# EAGLE design Rauchmelder 2.1b (EAGLE 6.2)
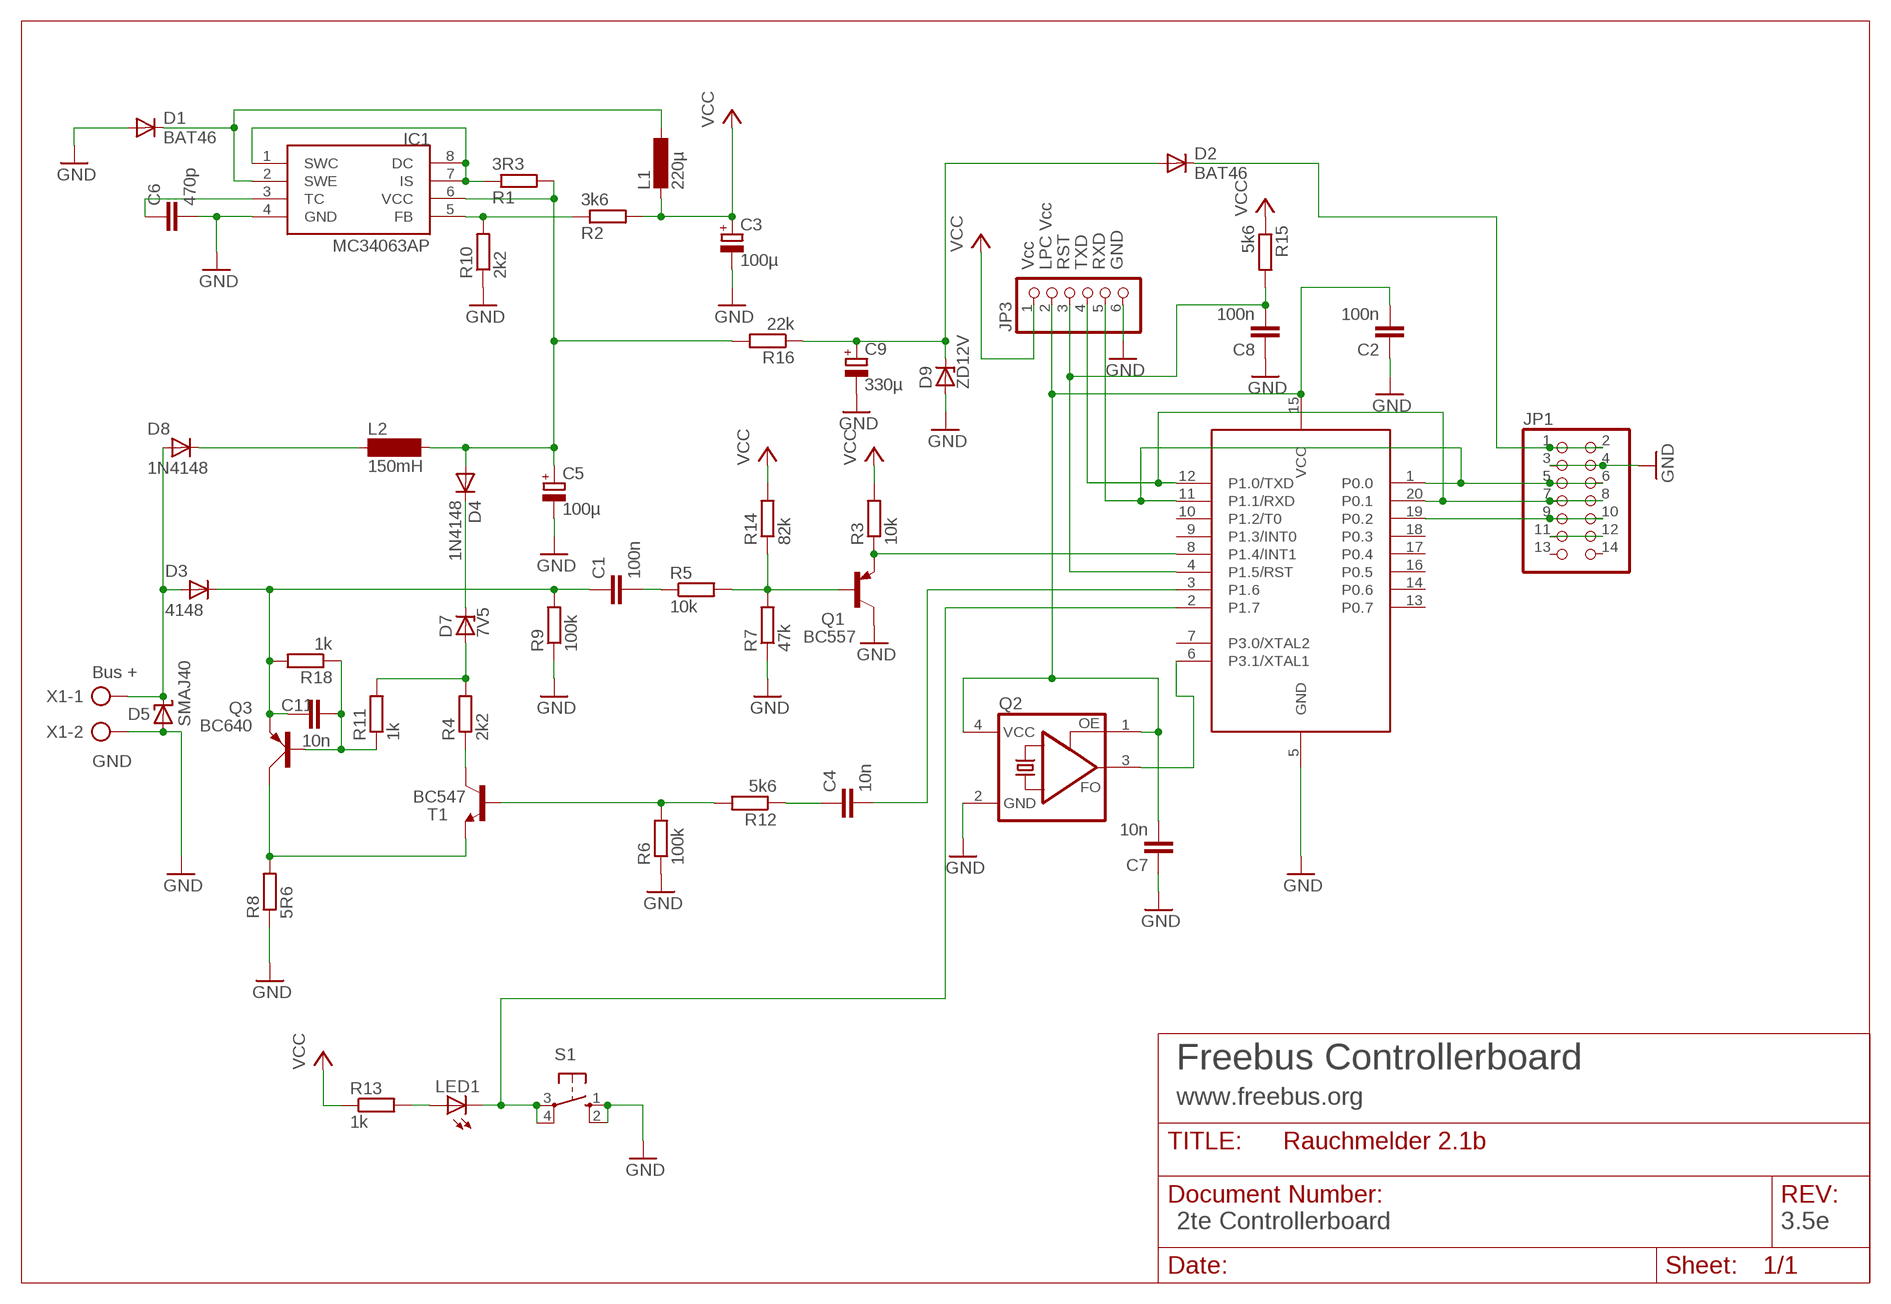
[diagram p0: schematic, sheet 1]

## Parts
89LPC922  89LPC922  [DIL20]
C1  100n  C-EU025-024X044  [C025-024X044]
C2  100n  C-EU025-024X044  [C025-024X044]
C3  100µ  CPOL-EUE2.5-6  [E2,5-6]
C4  10n  C-EU025-024X044  [C025-024X044]
C5  100µ  CPOL-EUE3.5-8  [E3,5-8]
C6  470p  C-EU025-024X044  [C025-024X044]
C7  10n  C-EUC1206  [C1206]
C8  100n  C-EU025-024X044  [C025-024X044]
C9  330µ  CPOL-EUE3.5-8  [E3,5-8]
C11  10n  C-EU025-024X044  [C025-024X044]
D1  BAT46  BAT81  [DO34-7]
D2  BAT46  BAT81  [DO34-7]
D3  4148  DO35-STEHEND  [DO35-S]
D4  1N4148  [DO35-10]
D5  SMAJ40  SUPPRESSOR-SMBJ  [SMBJ]
D7  7V5  BZX85ZDIOV  [ZDIO-2.5]
D8  1N4148  DO35-STEHEND  [DO35-S]
D9  ZD12V  BZX90  [DO34Z7]
IC1  MC34063AP  [DIL08]
JP1  PINHD-2X7  [2X07]
JP3  PINHD-1X6  [1X06]
L1  220µ  L-EU0207/12  [0207/12]
L2  150mH  BS11  [BS11]
LED1  LED3MM  [LED3MM]
Q1  BC557  [TO92]
Q2  ASFL  [ASF]
Q3  BC640  [SOT54D]
R1  3R3  R-EU_0207/7  [0207/7]
R2  3k6  R-EU_0207/7  [0207/7]
R3  10k  R-EU_0207/7  [0207/7]
R4  2k2  R-EU_0207/2V  [0207/2V]
R5  10k  R-EU_0207/7  [0207/7]
R6  100k  R-EU_0207/2V  [0207/2V]
R7  47k  R-EU_0207/7  [0207/7]
R8  5R6  R-EU_0207/2V  [0207/2V]
R9  100k  R-EU_0207/7  [0207/7]
R10  2k2  R-EU_0207/7  [0207/7]
R11  1k  R-EU_0207/2V  [0207/2V]
R12  5k6  R-EU_0207/7  [0207/7]
R13  1k  R-EU_0207/7  [0207/7]
R14  82k  R-EU_0207/7  [0207/7]
R15  5k6  R-EU_0207/2V  [0207/2V]
R16  22k  R-EU_0207/2V  [0207/2V]
R18  1k  R-EU_0207/2V  [0207/2V]
S1  10-XX  [B3F-10XX]
T1  BC547  [TO92]
X1  AK500/2  [AK500/2]

## Nets
EIB+: D3.P$1(A) D5.C D8.P$1(A) X1.1
GND: 89LPC922.5(GND) C2.1 C3.- C5.- C6.2 C7.1 C8.1 C9.- D1.A D5.A D9.A IC1.4(GND) JP1.3 JP1.4 JP3.6 Q1.3(C) Q2.2(GND) R6.1 R7.1 R8.1 R9.1 R10.1 S1.1(S) S1.2(S1) X1.2
N$1: 89LPC922.8(P1.4/INT1) Q1.1(E) R3.1
N$2: Q1.2(B) R5.2 R7.2 R14.1
N$3: 89LPC922.6(P3.1/XTAL1) Q2.3(FO)
N$4: C11.2 Q3.B R11.1 R18.1
N$5: 89LPC922.3(P1.6) C4.2
N$6: 89LPC922.15(VCC) C2.2 C7.2 JP3.2 Q2.1(OE) Q2.4(VCC)
N$7: 89LPC922.2(P1.7) LED1.K(C) S1.3(P) S1.4(P1)
N$8: IC1.1(SWC) IC1.7(IS) IC1.8(DC) R1.1
N$9: LED1.A R13.2
N$10: C9.+ D2.A D9.C R16.1
N$11: IC1.5(FB) R2.1 R10.2
N$12: D1.C IC1.2(SWE) L1.1
N$13: D8.P$2(B) L2.1
N$14: C6.1 IC1.3(TC)
N$15: D4.C D7.C
N$16: C1.2 R5.1
N$17: C5.+ D4.A IC1.6(VCC) L2.2 R1.2 R16.2
N$18: D2.C JP1.1 JP1.2
N$19: 89LPC922.4(P1.5/RST) C8.2 JP3.3 R15.2
N$21: 89LPC922.19(P0.2) JP1.9 JP1.10
N$22: C4.1 R12.1
N$23: R4.1 T1.3(C)
N$24: JP1.11 JP1.12
N$25: D7.A R4.2 R11.2
N$26: Q3.C R8.2 T1.1(E)
N$33: C1.1 C11.1 D3.P$2(B) Q3.E R9.2 R18.2
N$34: R6.2 R12.2 T1.2(B)
RX: 89LPC922.1(P0.0) 89LPC922.11(P1.1/RXD) JP1.5 JP1.6 JP3.5
TX: 89LPC922.12(P1.0/TXD) 89LPC922.20(P0.1) JP1.7 JP1.8 JP3.4
VCC: C3.+ JP3.1 L1.2 R2.2 R3.2 R13.1 R14.2 R15.1
Unconnected: 89LPC922.7(P3.0/XTAL2) 89LPC922.9(P1.3/INT0) 89LPC922.10(P1.2/T0) 89LPC922.13(P0.7) 89LPC922.14(P0.6) 89LPC922.16(P0.5) 89LPC922.17(P0.4) 89LPC922.18(P0.3) JP1.13 JP1.14

## Notes on the sheet
- Vcc | LPC Vcc | RST | TXD | RXD | GND
- Bus +
- GND
- Freebus Controllerboard
- www.freebus.org
- 2te Controllerboard | 3.5e

## Library data of the parts
89LPC922 = micro-philips:89LPC922
C1 C2 C4 C6-C8 C11 = rcl:C-EU: CAPACITOR, European symbol
C3 C5 C9 = rcl:CPOL-EU: POLARIZED CAPACITOR, European symbol
D1 D2 = diode:BAT81: DIODE barrier diode
D3 D8 = kubi:DO35-STEHEND
D4 = diode:1N4148: DIODE high speed (Philips)
D5 = diode:SUPPRESSOR-: Suppressor diode
D7 = diode:BZX85: Z DIODE
D9 = diode:BZX90: Z DIODE
IC1 = mc34063:MC34063
JP1 = pinhead:PINHD-2X7: PIN HEADER
JP3 = pinhead:PINHD-1X6: PIN HEADER
L1 = rcl:L-EU: INDUCTOR, European symbol
L2 = inductor-neosid:BS: INDUCTOR nominal inductance, magnetically screened
LED1 = led:LED: LED OSRAM: - CHIPLED LG R971, LG N971, LY N971, LG Q971, LY Q971, LO R971, LY R971 LH N974, LH R974 LS Q976, LO Q976, LY Q976 LO Q996 - Hyper CHIPLED LW Q18S LB Q993, LB Q99A, LB R99A - SideLED LS A670, LO A670, LY A670, LG A670, LP A670 LB A673, LV A673, LT A673, LW A673 LH A674 LY A675 LS A676, LA A676, LO A676, LY A676, LW A676 LS A679, LY A679, LG A679 - Hyper Micro SIDELED® LS Y876, LA Y876, LO Y876, LY Y876 LT Y87S - SmartLED LW L88C, LW L88S LB L89C, LB L89S, LG L890 LS L89K, LO L89K, LY L89K LS L896, LA L896, LO L896, LY L896 - TOPLED LS T670, LO T670, LY T670, LG T670, LP T670 LSG T670, LSP T670, LSY T670, LOP T670, LYG T670 LG T671, LOG T671, LSG T671 LB T673, LV T673, LT T673, LW T673 LH T674 LS T676, LA T676, LO T676, LY T676, LB T676, LH T676, LSB T676, LW T676 LB T67C, LV T67C, LT T67C, LS T67K, LO T67K, LY T67K, LW E67C LS E67B, LA E67B, LO E67B, LY E67B, LB E67C, LV E67C, LT E67C LW T67C LS T679, LY T679, LG T679 LS T770, LO T770, LY T770, LG T770, LP T770 LB T773, LV T773, LT T773, LW T773 LH T774 LS E675, LA E675, LY E675, LS T675 LS T776, LA T776, LO T776, LY T776, LB T776 LHGB T686 LT T68C, LB T68C - Hyper Mini TOPLED® LB M676 - Mini TOPLED Santana® LG M470 LS M47K, LO M47K, LY M47K Source: http://www.osram.convergy.de - LUMILED® LXK2-PW12-R00, LXK2-PW12-S00, LXK2-PW14-U00, LXK2-PW14-V00 LXK2-PM12-R00, LXK2-PM12-S00, LXK2-PM14-U00 LXK2-PE12-Q00, LXK2-PE12-R00, LXK2-PE12-S00, LXK2-PE14-T00, LXK2-PE14-U00 LXK2-PB12-K00, LXK2-PB12-L00, LXK2-PB12-M00, LXK2-PB14-N00, LXK2-PB14-P00, LXK2-PB14-Q00 LXK2-PR12-L00, LXK2-PR12-M00, LXK2-PR14-Q00, LXK2-PR14-R00 LXK2-PD12-Q00, LXK2-PD12-R00, LXK2-PD12-S00 LXK2-PH12-R00, LXK2-PH12-S00 LXK2-PL12-P00, LXK2-PL12-Q00, LXK2-PL12-R00 Source: www.luxeon.com
Q1 = transistor-pnp:BC557: PNP Transistor
Q2 = crystal:ASF*: CRYSTAL CLOCK OSCILLATORS 5.0 Vdc or 3.3 Vdc - LOW PROFILE ULTRA MINIATURE CERAMIC SURFACE MOUNT Source: http://www.abracon.com/Oscillators/asf1-L-L1.pdf
Q3 = transistor-small-signal:BC640: PNP TRANSISTOR
R1-R16 R18 = rcl:R-EU_: RESISTOR, European symbol
S1 = switch-omron:10-XX: OMRON SWITCH
T1 = transistor-neu-to92:BC547: NPN TRANSISTOR
X1 = con-ptr500:AK500/2: CONNECTOR

## Board
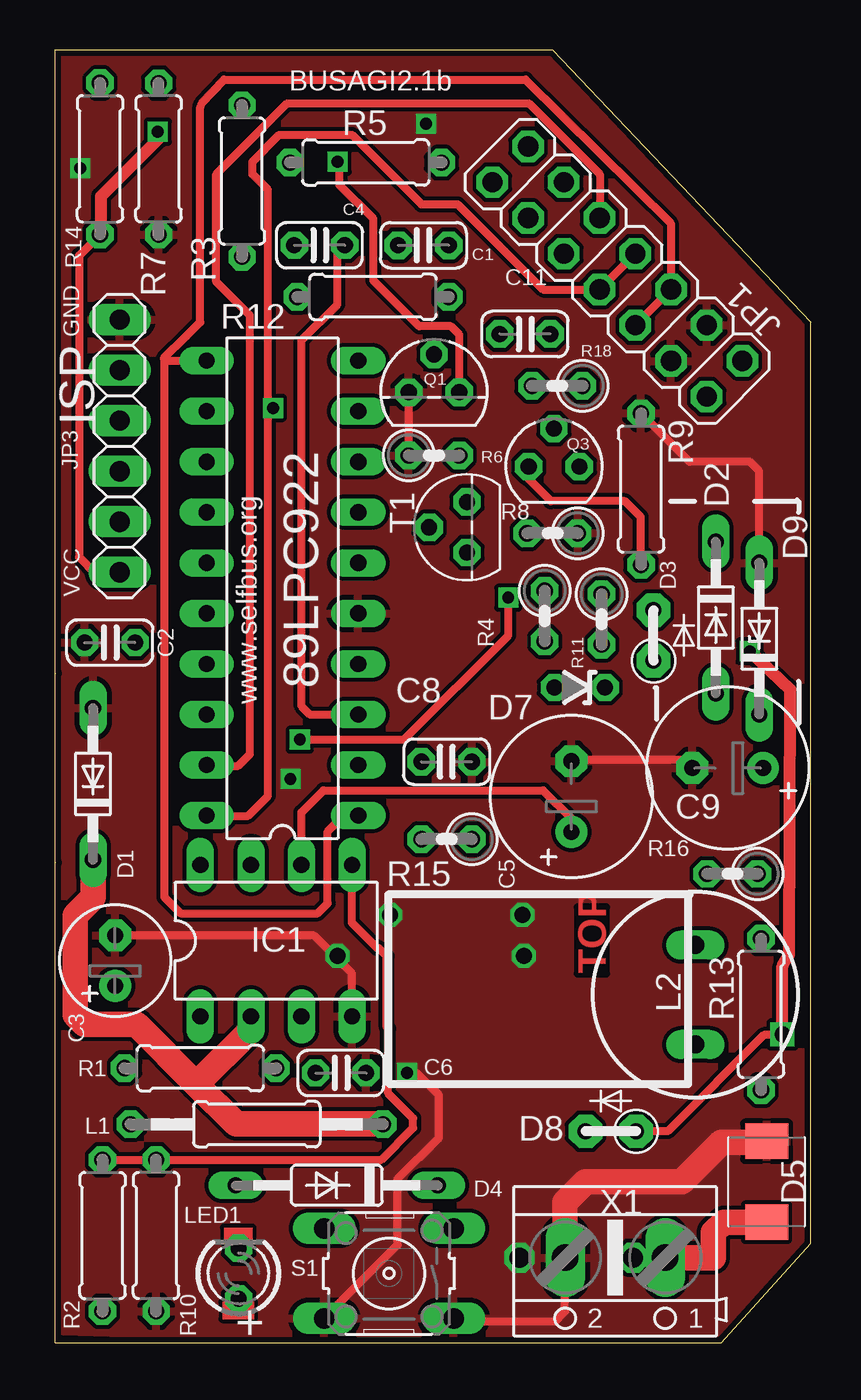
[diagram p1: board, top side]
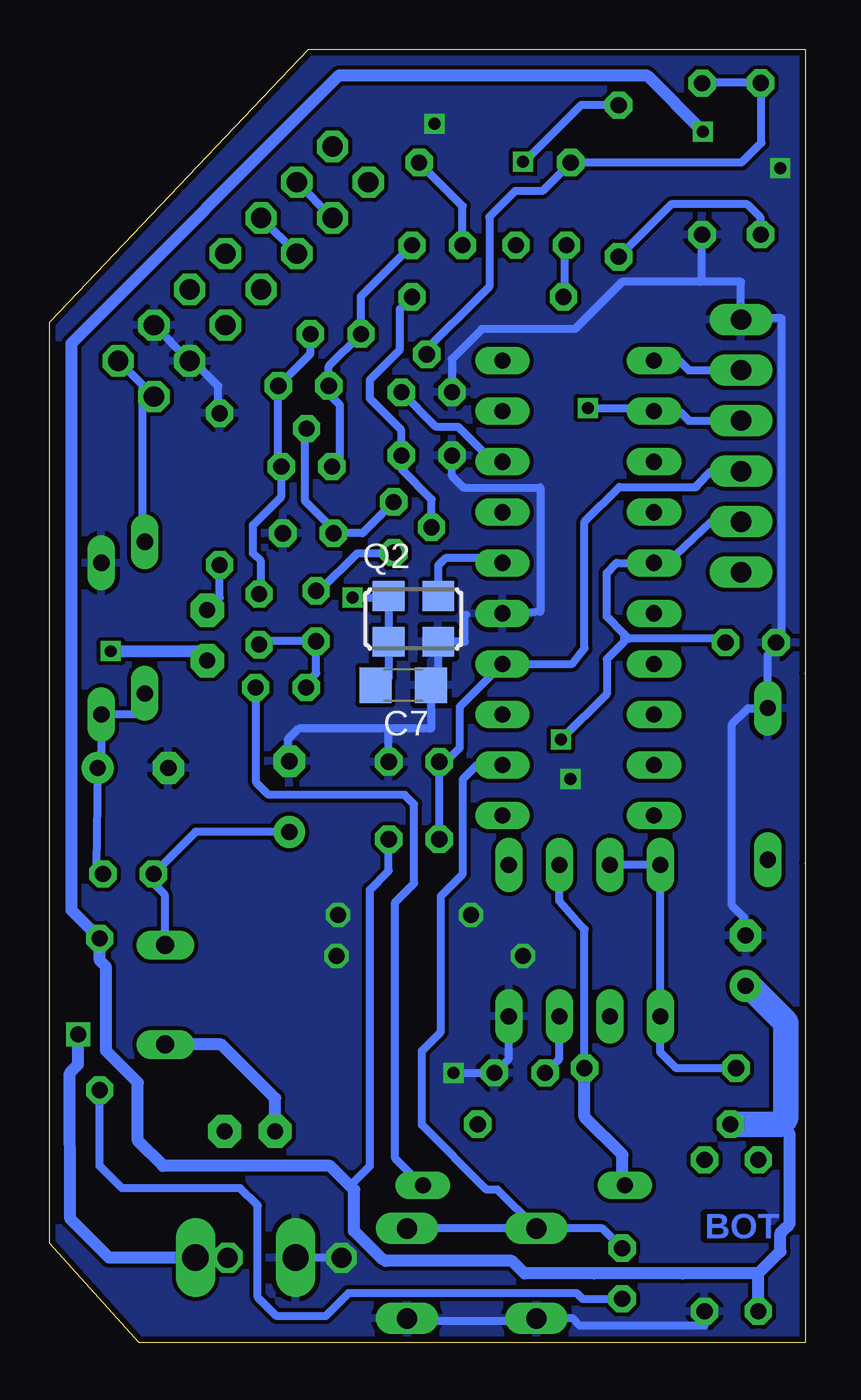
[diagram p2: board, bottom side, seen from below]

Size 38 x 65 mm. Coordinates in mm from the lower left corner, seen from the top.
Outline: 0,33.66 0.04,33.66
Outline: 0.04,24.13 0,24.13
Outline: 0,0 0,65 25,65 38,51.3 38,5 33.5,0 0,0
Copper layers (1*16): Top 0.035mm / dielectric 1.5mm / Bottom 0.035mm
Design rules: minimum track width 10mil, minimum drill 24mil, track to track 8mil, track to pad 8mil, pad to pad 8mil, via to via 8mil, smd to smd 8mil, copper to edge 12mil, drill to drill 8mil, minimum pad ring 11mil, minimum via ring 8mil, stop-mask expansion 4mil, vias tented up to drill 0mil, thermal gap 10mil
tRestrict: area 35.3,11.2 to 36.1,11.3; area 35.4,9 to 36.2,9.1; area 37,9.7 to 37.1,10.6

### Footprints (pad centres in the part's own frame; a part is rotated, then mirrored left to right if it is on the bottom)
DIL20@1 = drill 0.813 long: 1 -11.43,-3.81; 2 -8.89,-3.81; 3 -6.35,-3.81; 4 -3.81,-3.81; 5 -1.27,-3.81; 6 1.27,-3.81; 7 3.81,-3.81; 8 6.35,-3.81; 9 8.89,-3.81; 10 11.43,-3.81; 11 11.43,3.81; 12 8.89,3.81; 13 6.35,3.81; 14 3.81,3.81; 15 1.27,3.81; 16 -1.27,3.81; 17 -3.81,3.81; 18 -6.35,3.81; 19 -8.89,3.81; 20 -11.43,3.81
C025-024X044 = drill 0.813 octagon: 1 -1.27,0; 2 1.27,0
E2,5-6 = drill 0.813 pad 1.6: + -1.27,0 | drill 0.813 pad 1.6 octagon: - 1.27,0
E3,5-8 = drill 0.813 pad 1.6: + -1.778,0 | drill 0.813 pad 1.6 octagon: - 1.778,0
C1206 = smd 1.6 x 1.8: 1 -1.4,0; 2 1.4,0
DO34-7 = drill 0.813 long: A 3.81,0; C -3.81,0
DO35-S = drill 0.8 pad 1.676 octagon: P$1 -1.27,0; P$2 1.27,0
DO35-10 = drill 0.813 long: A 5.08,0; C -5.08,0
SMBJ = smd 1.78 x 2.16: A 2.04,0; C -2.03,0
ZDIO-2.5 = drill 0.813 octagon: A 1.27,0; C -1.27,0
DO34Z7 = drill 0.813 long: A 3.81,0; C -3.81,0
DIL08 = drill 0.813 long: 1 -3.81,-3.81; 2 -1.27,-3.81; 3 1.27,-3.81; 4 3.81,-3.81; 5 3.81,3.81; 6 1.27,3.81; 7 -1.27,3.81; 8 -3.81,3.81
2X07 = drill 1.016 octagon: 1 -7.62,-1.27; 2 -7.62,1.27; 3 -5.08,-1.27; 4 -5.08,1.27; 5 -2.54,-1.27; 6 -2.54,1.27; 7 0,-1.27; 8 0,1.27; 9 2.54,-1.27; 10 2.54,1.27; 11 5.08,-1.27; 12 5.08,1.27; 13 7.62,-1.27; 14 7.62,1.27
1X06 = drill 1.016 long: 1 -6.35,0; 2 -3.81,0; 3 -1.27,0; 4 1.27,0; 5 3.81,0; 6 6.35,0
0207/12 = drill 0.813 octagon: 1 -6.35,0; 2 6.35,0
BS11 = drill 0.9 long: 1 -2.5,0; 2 2.5,0
LED3MM = drill 0.813 octagon: A -1.27,0; K 1.27,0
TO92 = drill 0.813 octagon: 1 1.27,0; 2 0,1.905; 3 -1.27,0
ASF = smd 1.6 x 1.5: 1 -1.25,-1.15; 2 1.25,-1.15; 3 1.25,1.15; 4 -1.25,1.15
SOT54D = drill 0.813 octagon: B 1.27,0; C 0,1.905; E -1.27,0
0207/7 = drill 0.813 octagon: 1 -3.81,0; 2 3.81,0
0207/2V = drill 0.813 octagon: 1 -1.27,0; 2 1.27,0
B3F-10XX = drill 1.016 long: 1 -3.251,2.261; 2 3.251,2.261; 3 -3.251,-2.261; 4 3.251,-2.261
AK500/2 = drill 1.321 long: 1 -2.515,0; 2 2.515,0

### Placement (x,y rotation side)
89LPC922  89LPC922  [DIL20@1]  11.43,37.94 90 top
C1  18.52,55.17 180 top
C2  2.76,35.2 0 top
C3  3.02,19.21 90 top
C4  13.29,55.18 0 top
C5  25.96,27.46 90 top
C6  14.37,13.57 0 top
C7  20.23,33.06 180 bottom
C8  19.69,29.21 180 top
C9  33.81,28.89 180 top
C11  23.62,50.71 0 top
D1  1.91,28.1 90 top
D2  33.22,36.46 270 top
D3  30.08,35.56 90 top
D4  14.16,7.92 180 top
D5  35.77,8.1 90 top
D7  26.38,32.95 180 top
D8  27.94,10.64 180 top
D9  35.4,35.4 90 top
IC1  11.11,20.22 0 top
JP1  28.27,53.85 135 top
JP3  3.25,45.09 90 top
L1  10.14,11 180 top
L2  32.19,17.51 90 top
LED1  9.22,3.49 90 top
Q1  19.05,47.78 0 top
Q2  19.72,36.39 0 bottom
Q3  25.08,44.05 0 top
R1  7.3,13.81 0 top
R2  2.38,5.4 270 top
R3  9.4,58.4 270 top
R4  24.61,36.54 270 top
R5  15.62,59.33 180 top
R6  19.05,44.61 0 top
R7  5.21,59.51 90 top
R8  25.01,40.7 180 top
R9  29.46,42.92 270 top
R10  5.08,5.4 90 top
R11  27.48,36.37 270 top
R12  15.98,52.58 0 top
R13  35.49,16.52 270 top
R14  2.26,59.52 270 top
R15  19.69,25.32 180 top
R16  34.05,23.57 180 top
R18  25.24,48.1 180 top
S1  16.79,3.49 180 top
T1  20.71,41 90 top
X1  28.16,4.29 180 top

### Tracks (layer width: path | path; a pad name or v marks a point on that pad's centre or on a via)
EIB+  (via drill 0.6, 0.8, 1)
  Top 0.406: D8.P$1 30.8,10.64 35.64,15.48 36.95,15.48 v36.57,15.5
  Top 0.61: v36.57,15.5 36.57,18.95 36.91,19.53 36.97,32.83 34.96,34.73 v34.93,34.77
  Top 1.27: D5.C 33.61,6.07 33.1,5.56 33.1,4.29 X1.1 | X1.1
  Bottom 0.406: v29.05,4.29 X1.1
  Bottom 0.61: X1.1 35.02,4.29 36.97,6.24 36.99,13.57 36.57,13.99 v36.57,15.5 | v34.93,34.77 30.56,34.77 D3.P$1
GND  (via drill 0.6, 0.8, 1)
  Top 0.406: IC1.4 14.92,16.51 14.92,18.41 14.92,18.57 13.02,20.48 C3.- | C3.- | S1.2 17.22,4.92 17.22,8.26 19.29,10.32 19.29,12.46 18.18,13.57 v17.7,13.57 | Q1.3 R6.1 | D9.A 35.4,43.81 34.93,44.29 31.89,44.29 R9.1 | 20,1.1 25.15,1.1 25.64,1.59 X1.2 | 26.04,29.32 31.69,29.32 C9.-
  Top 1.27: D5.A 35.71,10.08 33.5,10.08 31.51,8.1 26.67,8.1 25.64,7.06 X1.2
  Bottom 0.406: 89LPC922.5 14.29,36.67 13.34,36.75 13.34,43 17.2,43 17.8,43.6 17.8,44.59 R6.1 | D1.A | D1.A | 20.1,1.1 20,1.1 | 20,1.1 13.6,1.1 S1.2 11.71,1.23 11.35,0.87 5.08,0.87 R10.1 | 20,1.1 20,1.07 S1.1 | D1.A 1.91,31.9 2.9,31.9 3.7,31.1 3.7,22 3.1,21.4 3.1,20.4 C3.- | 1.28,35.2 1.2,35.2 1.2,51.5 3.18,51.5 JP3.6 3.61,51.8 | 1.28,35.2 C2.1 | D1.A 1.9,34.58 1.28,35.2 | 3.61,51.8 3.71,51.9 | IC1.4 14.92,14.29 C6.2 v17.7,13.57 | v17.7,13.57 | Q1.3 17.78,49.45 16.27,50.96 11.59,50.96 9.21,53.34 5.32,53.34 | JP1.3 JP1.4 30.79,49.36 29.53,48.1 29.53,46.8 R9.1 | 5.32,53.34 3.25,53.34 3.25,52.15 3.61,51.8 | R7.1 5.21,53.45 5.32,53.34 | X1.2 25.56,4.2 | v23.34,4.29 25.48,4.29 | 25.48,4.29 25.56,4.29 | 25.56,4.29 25.56,4.21 25.48,4.21 25.48,4.29 | 25.56,4.29 X1.2 25.64,4.21 | 17.07,36.59 17.15,36.59 17.15,35.24 Q2.2 18.47,33.34 C7.1 18.83,30.89 18.89,30.88 21.03,30.88 | 21.03,30.88 25.48,30.88 26.04,30.32 26.04,29.32 C5.- | C8.1 20.96,30.8 21.03,30.88
  other vias: 14.21,19.45 16.83,21.51 23.5,21.51 23.57,19.45 1.27,59.05 18.65,61.28 11.83,28.34
  pour Top: -1.2,0.6 -1.2,66.1 -0.7,66.6 25.9,66.6 39.9,52.6 39.9,2.7 36.6,-0.6
  pour Bottom: -0.7,66.7 26.3,66.7 40.4,52.6 40.4,3.1 35.9,-1.4 -0.5,-1.4 -1.7,-0.2
N$1  (via drill 0.6)
  Top 0.406: Q1.1 20.32,48.26 20.32,50.68 19.9,51.1 18.3,51.1 16,53.4 16,56.5 14.3,58.2 14.3,59.28 v14.21,59.37
  Bottom 0.406: 89LPC922.8 15.72,44.29 | 15.72,44.29 | 15.72,44.29 17.46,46.04 18.57,46.04 Q1.1 | v14.21,59.37 14.13,59.37 11.27,62.23 9.41,62.23 R3.1
N$2
  Bottom 0.406: Q1.2 19,49.74 19,50 16.4,52.6 | 16.4,52.6 16.3,52.7 | 16.4,52.6 15.9,53.1 15.9,56.6 14.6,57.9 13.24,57.9 R5.2 3.22,59.33 2.22,60.33 2.22,63.3 R14.1 5.2,63.33 R7.2 5.24,63.29
N$3
  Bottom 0.406: 89LPC922.6 15.48,39.45 18.1,39.45 18.47,39.08 Q2.3
N$4
  Bottom 0.406: C11.2 24.89,49.72 R18.1 26.51,44.21 Q3.B 26.35,42.55 27.78,41.12 27.78,39.69 27.38,39.29 27.38,37.73 R11.1
N$5
  Top 0.406: C4.2 14.2,54.74 14.2,52.2 12.4,50.4 12.4,32 12.8,31.6 89LPC922.3
N$6  (via drill 0.6)
  Top 0.406: v12.3,30.32 17.54,30.32 22.78,35.56 v22.78,37.47
  Bottom 0.406: 3.18,41.27 4.45,41.27 JP3.2 4.76,41.27 6.99,39.21 89LPC922.15 9.5,39.2 10,38.7 10,36.5 9.13,35.63 | C2.2 4.02,35.4 8.9,35.4 9.13,35.63 | C7.2 20.97,33.4 Q2.1 Q2.4 21.45,37.47 v22.78,37.47 | v12.3,30.32 10,32.62 10,34.37 9.13,35.24 9.13,35.63
N$7
  Bottom 0.406: LED1.K 10.21,5.75 S1.4 | S1.4 S1.3 | S1.4 15.48,7.7 16.03,7.7 19.29,10.95 19.29,14.68 18.34,15.64 18.34,22.46 17.22,23.57 17.22,28.34 16.51,29.05 89LPC922.2
N$8
  Bottom 0.406: IC1.7 | IC1.7 IC1.8 7.3,24.13 7.3,16.51 | IC1.7 | R1.1 5.24,13.81 6.51,13.81 7.3,14.61 7.3,16.51 | 7.3,16.51 | 7.3,16.51 IC1.1
N$9
  Bottom 0.406: 9.2,2.2 | LED1.A 9.2,2.2 | 9.2,2.2 11.2,2.2 11.5,2.5 22.98,2.5 24.13,1.35 26.59,1.35 27.54,2.3 27.54,6.91 28.42,7.78 34.37,7.78 35.49,8.9 R13.2
N$10
  Bottom 0.406: D2.A 33.22,31.79 33.42,31.59 D9.C | D9.C | D9.C 35.4,29.16 C9.+ 35.67,23.92 R16.1
N$11
  Top 0.406: 14.92,24.13 | 14.92,24.13 IC1.5 | 14.92,24.13 14.92,21.11 16.19,19.84 16.27,19.84 16.67,19.45 16.67,15.88 16.75,15.8 16.75,12.55 18,11.3 18,10.8 16.41,9.21 R10.2 2.54,9.21 R2.1 | R2.1
N$12
  Top 1.27: D1.C 1.91,22.41 1,21.5 1,16.5 1.5,16 4.1,16 7.1,13 | 7.1,13 9.1,11 L1.1 | IC1.2 9.84,15.74 7.1,13
N$13
  Bottom 0.61: D8.P$2 26.67,10.79 26.67,12.3 29.37,15.01 L2.1
N$14
  Bottom 0.406: C6.1 12.38,14.29 IC1.3
N$15
  Bottom 0.406: D4.C 19.27,7.92 20.64,9.29 20.64,22.15 19.69,23.1 19.69,27.07 20.16,27.54 23.42,27.54 24.29,27.54 26.99,27.54 27.62,28.18 27.62,32.92 D7.C
N$16
  Bottom 0.406: C1.2 17.25,57.15 R5.1
N$17
  Top 0.406: IC1.6 12.38,26.67 13.49,27.78 24.53,27.78 25.96,26.35 C5.+ | C5.+
  Bottom 0.406: 12.38,24.13 | 12.38,24.13 IC1.6 | 12.38,24.13 12.38,22.23 11.11,20.8 11.11,13.97 R1.2 | L2.2 32.23,20.04 32.23,22.54 32.78,23.1 R16.2 30.67,25.69 C5.+
  Bottom 0.61: R1.2 11.11,11.35 9.21,9.45 9.21,8.05 D4.A
N$18
  Bottom 0.406: 33.34,47.31 33.34,40 D2.C | 33.34,47.31 33.02,47.31 JP1.2 | 33.34,47.31 33.34,48.14 JP1.1
N$19
  Bottom 0.406: JP3.3 4.76,43.81 5.48,43.1 5.48,43.02 9.37,43.02 11.11,41.27 11.11,34.92 11.75,34.13 89LPC922.4 17.38,31.99 17.38,29.92 18.1,29.21 C8.2 R15.2
N$21
  Top 0.406: 89LPC922.19 7.6,29.03 7.6,29 9.2,29 9.8,29.6 9.8,51.32 9.8,51.64 8.1,53.34 8.1,58.74 11.67,62.31 23.81,62.31 27.38,58.74 27.38,56.56 JP1.9
  Bottom 0.406: JP1.9 JP1.10
N$22
  Bottom 0.406: 12.1,54.9 12,55 | 12.1,54.9 C4.1 | R12.1 12.1,52.71 12.1,54.9
N$23
  Bottom 0.406: R4.1 24.42,37.81 22.54,39.69 20.75,39.69 T1.3
N$24
  Bottom 0.406: JP1.12 JP1.11
N$25
  Bottom 0.406: D7.A 25.11,33.16 24.61,33.66 R4.2 27.31,35.27 R11.2
N$26
  Bottom 0.406: Q3.C 25.16,45.88 25.16,42.31 23.74,40.88 R8.2 22.28,40.7 T1.1
N$33
  Top 0.406: Q3.E 23.81,43.42 24.92,42.31 28.65,42.31 29.45,41.51 R9.2
  Bottom 0.406: Q3.E 23.42,44.45 23.42,47.15 23.97,47.7 R18.2 23.97,49.09 C11.1 22.35,52.6 C1.1 | R9.2 29.46,37.46 D3.P$2
N$34
  Bottom 0.406: 20.3,44.63 20.3,44.7 | T1.2 18.8,42.4 20.3,43.9 20.3,44.63 | 20.3,44.63 20.3,44.8 | 20.3,44.63 R6.2 20.32,45.88 21.91,47.47 21.91,48.42 20.4,49.93 20.4,51.97 R12.2
RX
  Top 0.406: 89LPC922.1 15.3,26.5 | 89LPC922.1 | 89LPC922.1 14.5,26.5 13.7,25.7 13.7,22.1 13.2,21.6 6.3,21.6 5.5,22.4 5.5,49.37 | 5.5,49.37 5.47,49.49 6.6,50.6 7.3,51.3 7.3,62.11 7.38,62.31 8.49,63.5 23.65,63.5 30.96,56.28 JP1.5 JP1.6 | 5.5,49.37 6.13,49.37 89LPC922.11
  Bottom 0.406: JP3.5 5.87,48.9 6.35,49.37 89LPC922.11
TX  (via drill 0.6)
  Top 0.406: 7.62,26.42 7.6,26.4 | 89LPC922.20 7.62,26.42 | 7.62,26.42 7.7,26.5 9.7,26.5 10.7,27.5 10.7,46.99 | 10.7,46.99 v10.95,46.99 | 10.7,46.99 10.7,57.96 9.92,58.74 9.92,59.37 11.27,60.72 14.92,60.72 18.42,57.23 20.24,57.23 24.53,52.94 JP1.8 JP1.7
  Bottom 0.406: JP3.4 5.87,46.35 6.35,46.83 89LPC922.12 7.78,46.99 v10.95,46.99
VCC  (via drill 0.6)
  Top 0.406: JP3.1 3.27,38.73 3.3,38.7 2,38.7 1.2,39.5 1.2,54.65 R14.2
  Top 0.61: v5.16,60.88 5.16,60.48 2.3,57.63 2.3,55.76 R14.2
  Bottom 0.406: 21.11,4.13 21.22,4.18 | R15.1 20.96,23.73 21.91,22.78 21.91,8.89 22.9,7.9 | R14.2 2.26,56.55 2.94,57.23 6.76,57.23 R3.2 | 10.64,3.49 | 2.38,3.49 | R2.2
  Bottom 0.61: 21.11,4.13 14.76,4.13 14.13,3.49 10.64,3.49 6.19,3.49 2.38,3.49 | 2.38,3.49 1.27,4.6 1.27,5.42 arc45 1.2,5.6 0.8,6 0.8,10.42 arc-45 0.87,10.6 1.27,10.99 | R2.2 2.38,3.49 | v5.16,60.88 7.99,63.71 18.32,63.71 23.44,63.71 36.91,50.25 36.91,33.4 36.91,21.75 R13.1 35.49,19.22 35.16,18.89 35.17,14.69 33.58,13.1 33.58,10.17 32.31,8.9 23.9,8.9 22.9,7.9 22.7,7.7 22.7,5.64 21.3,4.23 21.22,4.18
  Bottom 1.27: C3.+ 2.94,17.94 arc45 2.77,17.86 1,16.1 1,11.37 arc45 1.07,11.19 1.27,10.99 L1.2 | L1.2 arc-45 L1.2
(copper drawn outside any net)
  shapes: Top area x2

### Text on the board
Top: TOP
Bottom: BOT
tPlace: BUSAGI2.1b | +
tNames: GND | ISP | VCC | www.selfbus.org
tValues: 16V